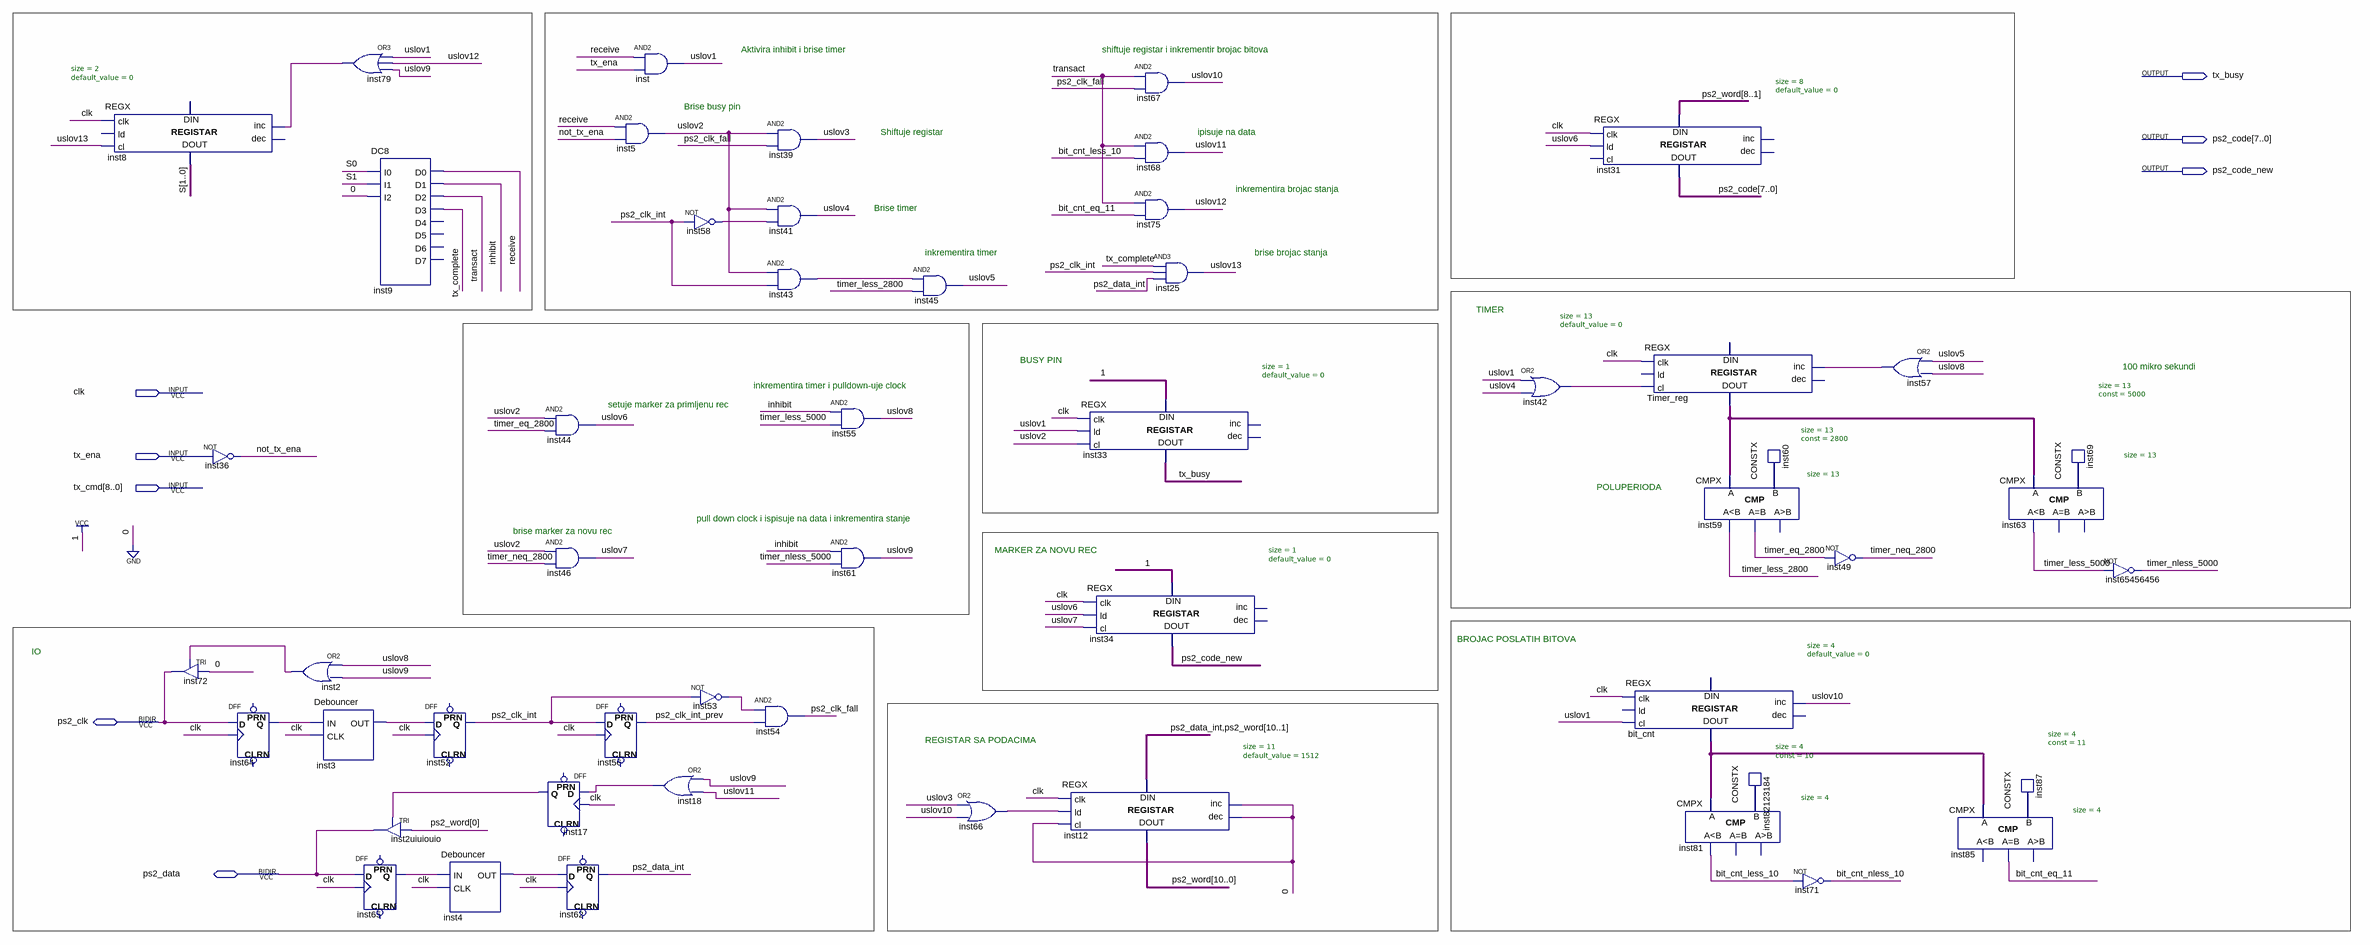
[diagram p0: schematic sheet]
// Quartus schematic MouseTransiver.bdf as structural Verilog: 53 symbols, 8 pins
module MouseTransiver (
  input  clk,
  input  tx_ena,
  input  [8:0] tx_cmd,
  inout  ps2_clk,
  inout  ps2_data,
  output tx_busy,
  output [7:0] ps2_code,
  output ps2_code_new
);

  wire bit_cnt_eq_11, bit_cnt_less_10, bit_cnt_nless_10, inhibit, inst2_out, inst3_out, inst4_out, inst17_q,
       inst18_out, inst42_out, inst43_out, inst53_out, inst57_out, inst58_out, inst64_q, inst65_q,
       inst66_out, inst79_out, not_tx_ena, ps2_clk_fall, ps2_clk_int, ps2_clk_int_prev, ps2_data_int,
       receive, timer_eq_2800, timer_less_2800, timer_less_5000, timer_neq_2800, timer_nless_5000, transact,
       tx_complete, uslov1, uslov2, uslov3, uslov4, uslov5, uslov6, uslov7, uslov8, uslov9, uslov10, uslov11,
       uslov12, uslov13;
  wire [1:0] S;
  wire [3:0] bit_cnt_data_out, inst87_data, inst82123184_data;
  wire [10:0] ps2_word;
  wire [12:0] inst60_data, inst69_data, Timer_reg_data_out;

  REGX #(.size(2), .default_value(0)) inst8 (
    .clk(clk), .cl(uslov13), .inc(inst79_out), .data_out(S));  // open: ld, dec, data_in
  not inst36 (not_tx_ena, tx_ena);
  TRI inst72 (.IN(1'b0), .OE(inst2_out), .OUT(ps2_clk));
  DFF inst64 (.CLK(clk), .D(ps2_clk), .Q(inst64_q));  // open: CLRN, PRN
  or inst2 (inst2_out, uslov8, uslov9);
  Debouncer inst3 (.IN(inst64_q), .CLK(clk), .OUT(inst3_out));
  or inst79 (inst79_out, uslov1, uslov12, uslov9);
  DC8 inst9 (
    .I0(S[0]), .I1(S[1]), .I2(1'b0), .D0(receive), .D1(inhibit), .D2(transact), .D3(tx_complete));  // open: D4, D5, D6, D7
  DFF inst65 (.CLK(clk), .D(ps2_data), .Q(inst65_q));  // open: CLRN, PRN
  TRI inst2uiuiouio (.IN(ps2_word[0]), .OE(inst17_q), .OUT(ps2_data));
  DFF inst52 (.CLK(clk), .D(inst3_out), .Q(ps2_clk_int));  // open: CLRN, PRN
  Debouncer inst4 (.IN(inst65_q), .CLK(clk), .OUT(inst4_out));
  and inst44 (uslov6, uslov2, timer_eq_2800);
  and inst46 (uslov7, uslov2, timer_neq_2800);
  DFF inst17 (.CLK(clk), .D(inst18_out), .Q(inst17_q));  // open: CLRN, PRN
  DFF inst62 (.CLK(clk), .D(inst4_out), .Q(ps2_data_int));  // open: CLRN, PRN
  and inst5 (uslov2, receive, not_tx_ena);
  DFF inst56 (.CLK(clk), .D(ps2_clk_int), .Q(ps2_clk_int_prev));  // open: CLRN, PRN
  and inst (uslov1, receive, tx_ena);
  or inst18 (inst18_out, uslov9, uslov11);
  not inst58 (inst58_out, ps2_clk_int);
  not inst53 (inst53_out, ps2_clk_int);
  and inst39 (uslov3, uslov2, ps2_clk_fall);
  and inst41 (uslov4, uslov2, inst58_out);
  and inst43 (inst43_out, uslov2, ps2_clk_int);
  and inst54 (ps2_clk_fall, inst53_out, ps2_clk_int_prev);
  and inst55 (uslov8, inhibit, timer_less_5000);
  and inst61 (uslov9, inhibit, timer_nless_5000);
  and inst45 (uslov5, inst43_out, timer_less_2800);
  or inst66 (inst66_out, uslov3, uslov10);
  REGX #(.size(1), .default_value(0)) inst33 (
    .clk(clk), .ld(uslov1), .cl(uslov2), .data_in(1'b1), .data_out(tx_busy));  // open: inc, dec
  REGX #(.size(11), .default_value(1512)) inst12 (
    .clk(clk), .ld(inst66_out), .cl(1'b0), .inc(1'b0), .dec(1'b0), .data_in({ps2_data_int, ps2_word[10:1]}),
    .data_out(ps2_word));
  REGX #(.size(1), .default_value(0)) inst34 (
    .clk(clk), .ld(uslov6), .cl(uslov7), .data_in(1'b1), .data_out(ps2_code_new));  // open: inc, dec
  and inst67 (uslov10, transact, ps2_clk_fall);
  and inst68 (uslov11, transact, bit_cnt_less_10);
  and inst75 (uslov12, transact, bit_cnt_eq_11);
  and inst25 (uslov13, tx_complete, ps2_clk_int, ps2_data_int);
  or inst42 (inst42_out, uslov1, uslov4);
  REGX #(.size(8), .default_value(0)) inst31 (
    .clk(clk), .ld(uslov6), .data_in(ps2_word[8:1]), .data_out(ps2_code));  // open: cl, inc, dec
  REGX #(.size(4), .default_value(0)) bit_cnt (
    .clk(clk), .cl(uslov1), .inc(uslov10), .data_out(bit_cnt_data_out));  // open: ld, dec, data_in
  REGX #(.size(13), .default_value(0)) Timer_reg (
    .clk(clk), .cl(inst42_out), .inc(inst57_out), .data_out(Timer_reg_data_out));  // open: ld, dec, data_in
  CMPX #(.size(4)) inst81 (.A(bit_cnt_data_out), .B(inst82123184_data), .ls(bit_cnt_less_10));  // open: eq, gr
  CMPX #(.size(13)) inst59 (
    .A(Timer_reg_data_out), .B(inst60_data), .ls(timer_less_2800), .eq(timer_eq_2800));  // open: gr
  CONSTX #(.size(4), .\const (10)) inst82123184 (.data(inst82123184_data));
  CONSTX #(.size(13), .\const (2800)) inst60 (.data(inst60_data));
  not inst49 (timer_neq_2800, timer_eq_2800);
  not inst71 (bit_cnt_nless_10, bit_cnt_less_10);
  or inst57 (inst57_out, uslov5, uslov8);
  CMPX #(.size(4)) inst85 (.A(bit_cnt_data_out), .B(inst87_data), .eq(bit_cnt_eq_11));  // open: ls, gr
  CMPX #(.size(13)) inst63 (.A(Timer_reg_data_out), .B(inst69_data), .ls(timer_less_5000));  // open: eq, gr
  CONSTX #(.size(4), .\const (11)) inst87 (.data(inst87_data));
  CONSTX #(.size(13), .\const (5000)) inst69 (.data(inst69_data));
  not inst65456456 (timer_nless_5000, timer_less_5000);

  // Notes on the sheet:
  //   Aktivira inhibit i brise timer
  //   shiftuje registar i inkrementir brojac bitova
  //   Brise busy pin
  //   Shiftuje registar
  //   ipisuje na data
  //   inkrementira brojac stanja
  //   Brise timer
  //   inkrementira timer
  //   brise brojac stanja
  //   TIMER
  //   BUSY PIN
  //   100 mikro sekundi
  //   inkrementira timer i pulldown-uje clock
  //   setuje marker za primljenu rec
  //   POLUPERIODA
  //   pull down clock i ispisuje na data i inkrementira stanje
  //   brise marker za novu rec
  //   MARKER ZA NOVU REC
  //   BROJAC POSLATIH BITOVA
  //   IO
  //   REGISTAR SA PODACIMA
endmodule
